# EasyEDA Pro project ProProject_nano驱动Dynamixal_2025-06-04.epro

# Board PCB1
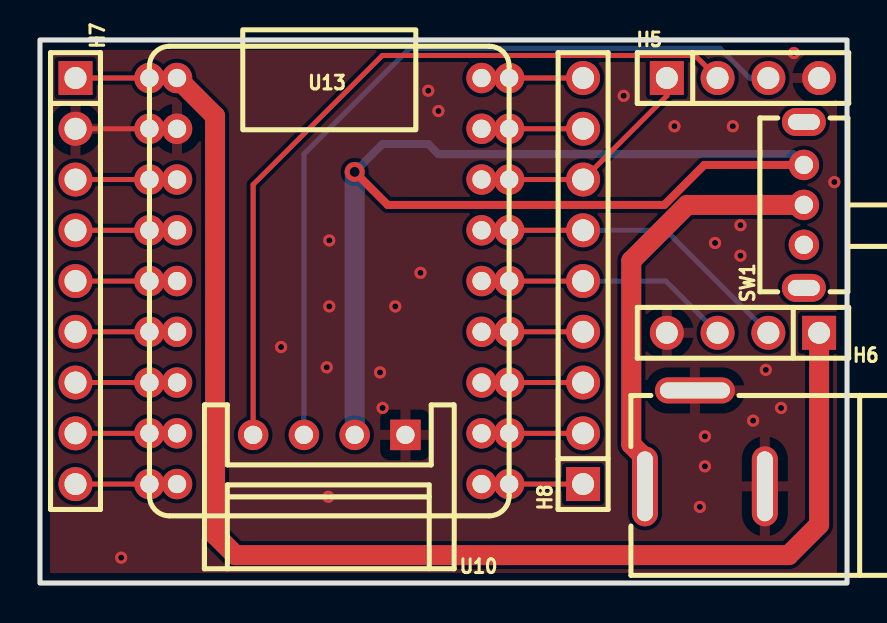
[diagram p0: board, top side]
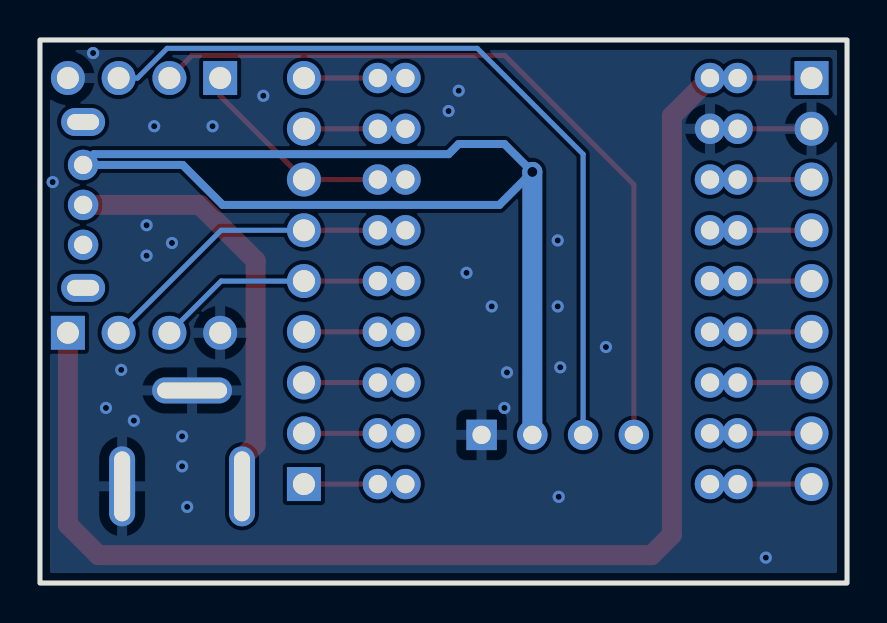
[diagram p1: board, bottom side, seen from below]

Outline 40.39 x 27.18 mm; copper layers: Top Layer, Bottom Layer. Coordinates in mm from the lower left corner of the outline.
Outline path: rectangle 0,27.18 40.39,0
Stack: Top Layer 0.035mm / Dielectric1 1.51mm FR4 er 4.5 / Bottom Layer 0.035mm

## Design rules (mm)
template: JLCPCB Capability(Two Layers Board)
spacing copperThickness1oz (default): track to track 0.102, other pairs 0.152 to 0.3
spacing copperThickness2oz: track to track 0.203, other pairs 0.152 to 0.3
track width copperThickness1oz (default): min 0.127, default 0.254, max 2.54
track width copperThickness2oz: min 0.203, default 0.254, max 2.54
differential pair differentialPair (default): width min 0.127, default 0.254, max 2.54; gap min 0.152, default 0.152
via viaSize (default): diameter min 0.5, default 0.61, max 10; hole min 0.3, default 0.305, max 6.3

## Placement (name value [footprint] x y rotation side)
DC1  null  [DC-IN-TH_DC-5520-1]  33.27 7.24 180 top
H5  null  [HDR-TH_4P-P2.54-V-F]  35.18 25.27 0 top
H6  null  [HDR-TH_4P-P2.54-V-F]  35.18 12.52 180 top
H7  null  [HDR-TH_9P-P2.54-V-M]  1.78 15.11 270 top
H8  null  [HDR-TH_9P-P2.54-V-M]  27.18 15.11 90 top
SW1  null  [SW-TH_SK12D07VG4]  38.23 18.92 90 top
U10  null  [CONN-TH_S4B-EH-LF-SN]  14.48 7.41 180 top
U13  -  [微雪esp32s3TINY_2]  6.86 25.27 0 top

## Footprints (pads in the part's own frame, mm; a bottom-side part is the same pattern mirrored in y, then rotated)
CONN-TH_S4B-EH-LF-SN
  rect 1.524x1.524 hole 0.914: 1(-3.81,0)
  round 1.524 hole 0.914: 2(-1.27,0) 3(1.27,0) 4(3.81,0)
DC-IN-TH_DC-5520-1
  oval 4x1.3 hole 3.5x0.8: 2(0.5,-2.4)
  oval 1.3x4 hole 0.8x3.5: 3(-3,2.4) 4(3,2.4)
HDR-TH_4P-P2.54-V-F
  rect 1.7x1.7 hole 1.1: 1(-3.81,0)
  round 1.7 hole 1.1: 2(-1.27,0) 3(1.27,0) 4(3.81,0)
HDR-TH_9P-P2.54-V-M
  rect 1.7x1.7 hole 1.1: 1(-10.16,0)
  round 1.7 hole 1.1: 2(-7.62,0) 3(-5.08,0) 4(-2.54,0) 5(0,0) 6(2.54,0) 7(5.08,0) 8(7.62,0) 9(10.16,0)
SW-TH_SK12D07VG4
  round 1.524 hole 0.914: 1(-2,0) 2(0,0) 3(2,0)
  oval 1.4x2.2 hole 0.8x1.6: 4(4.15,0) 5(-4.15,0)
微雪esp32s3TINY_2
  round 1.524 hole 0.914: 1(-1.38,-7.62) 1(0,-7.62) 2(-1.38,-10.16) 2(0,-10.16) 3(-1.38,-12.7) 3(0,-12.7) 3V3(-1.38,-5.08) 3V3(0,-5.08) 4(-1.38,-15.24) 4(0,-15.24) 5(-1.38,-17.78) 5(0,-17.78) 5V(-1.38,0) 5V(0,0) 6(-1.38,-20.32) 6(0,-20.32) 7(15.24,-20.32) 7(16.62,-20.32) 8(15.24,-17.78) 8(16.62,-17.78) 9(15.24,-15.24) 9(16.62,-15.24) 10(15.24,-12.7) 10(16.62,-12.7) 11(15.24,-10.16) 11(16.62,-10.16) 12(15.24,-7.62) 12(16.62,-7.62) 13(15.24,-5.08) 13(16.62,-5.08) GND(-1.38,-2.54) GND(0,-2.54) RX(15.24,-2.54) RX(16.62,-2.54) TX(15.24,0) TX(16.62,0)

## Nets
3V3: H7.3 U13.3V3
+5V: H6.1 H7.1 U13.5V
GND: DC1.2 DC1.3 H5.4 H6.4 H7.2 U10.1 U13.GND
VCC: SW1.3 U10.2
1: H7.4 U13.1
2: H7.5 U13.2
3: H7.6 U13.3
4: H7.7 U13.4
5: H7.8 U13.5
6: H7.9 U13.6
7: H8.1 U13.7
8: H8.2 U13.8
9: H8.3 U13.9
10: H8.4 U13.10
11: H6.3 H8.5 U13.11
12: H6.2 H8.6 U13.12
13: H5.1 H8.7 U13.13
485A: H5.3 U10.3
485B: H5.2 U10.4
DC_VCC: DC1.4 SW1.2
RX: H8.8 U13.RX
TX: H8.9 U13.TX

Pads without a net: SW1 1 4 5

## Via types
v1: diameter 0.61, hole 0.305, Top Layer to Bottom Layer, 26 vias
v2: diameter 1, hole 0.5, Top Layer to Bottom Layer, 1 via

## Routing (per net, layer and track width the routed paths; a pad name or vN(x,y) marks a point on that pad's centre or on a via; arc(x,y) is an arc through that point)
3V3: length 3.7
  Top Layer w0.254: U13.3V3 H7.3
+5V: length 68.2
  Top Layer w0.254: U13.5V H7.1
  Top Layer w1: U13.5V 8.76,23.37 8.76,2.41 9.78,1.4 37.47,1.4 38.99,2.92 H6.1
GND: length 3.7
  Top Layer w0.254: 5.48,22.73 H7.2
  vias: v1(4.06,1.27) v1(12.06,11.81) v1(14.35,10.8) v1(14.48,17.14) v1(14.48,13.84) v1(14.43,4.31) v1(17.02,10.54) v1(17.15,8.76) v1(17.78,13.84) v1(19.04,15.52) v1(19.43,24.64) v1(19.94,23.62) v1(29.21,24.38) v1(31.75,22.86) v1(33.02,3.81) v1(33.27,7.34) v1(33.27,5.84) v1(33.78,17.02) v1(34.67,22.86) v1(35.05,17.91) v1(35.05,16.38) v1(35.69,8.13) v1(36.32,10.67) v1(37.08,8.76) v1(37.73,26.52) v1(39.75,20.07)
VCC: length 84.6
  Top Layer w0.4: v2(15.75,20.57) 17.4,18.92 31.24,18.92 33.24,20.92 SW1.3
  Bottom Layer w0.4: 17.15,21.97 19.43,21.97 19.94,21.46 37.69,21.46 SW1.3 33.24,20.92 31.24,18.92 17.4,18.92 v2(15.75,20.57) 17.15,21.97
  Bottom Layer w1: v2(15.75,20.57) U10.2
1: length 3.7
  Top Layer w0.254: 5.48,17.65 H7.4
2: length 3.7
  Top Layer w0.254: U13.2 H7.5
3: length 3.7
  Top Layer w0.254: 5.48,12.57 1.78,12.57
4: length 3.7
  Top Layer w0.254: U13.4 H7.7
5: length 3.7
  Top Layer w0.254: H7.8 U13.5
6: length 3.7
  Top Layer w0.254: H7.9 5.48,4.95
7: length 3.7
  Top Layer w0.254: 23.48,4.95 H8.1
8: length 3.7
  Top Layer w0.254: U13.8 H8.2
9: length 3.7
  Top Layer w0.254: U13.9 H8.3
10: length 3.7
  Top Layer w0.254: 23.48,12.57 27.18,12.57
11: length 11.5
  Top Layer w0.254: U13.11 H8.5
  Bottom Layer w0.254: H6.3 31.32,15.11 H8.5
12: length 15.1
  Top Layer w0.254: 23.48,17.65 H8.6
  Bottom Layer w0.254: H6.2 31.32,17.65 H8.6
13: length 10.5
  Top Layer w0.254: H5.1 31.37,24.38 H8.7 U13.13
485A: length 40.1
  Bottom Layer w0.254: U10.3 13.21,21.46 18.5,26.76 34.02,26.76 35.51,25.27 H5.3
485B: length 38.9
  Top Layer w0.254: U10.4 10.67,19.94 17.13,26.4 32.78,26.4 H5.2
DC_VCC: length 21.4
  Top Layer w1: SW1.2 32.38,18.92 29.59,16.13 29.59,6.94 30.27,6.25 DC1.4
RX: length 3.7
  Top Layer w0.254: 23.48,22.73 H8.8
TX: length 3.7
  Top Layer w0.254: U13.TX H8.9

## Copper pours and planes (outline as drawn; the poured copper is in the pictures)
GND on Top Layer: -19.18,36.07 59.06,36.07 59.06,-5.84 -19.18,-5.84
GND on Bottom Layer: -7.87,30.61 52.58,30.61 52.58,-4.06 -7.87,-4.06
